# EAGLE design Sensor_LED_PCB (EAGLE 8.0.1)
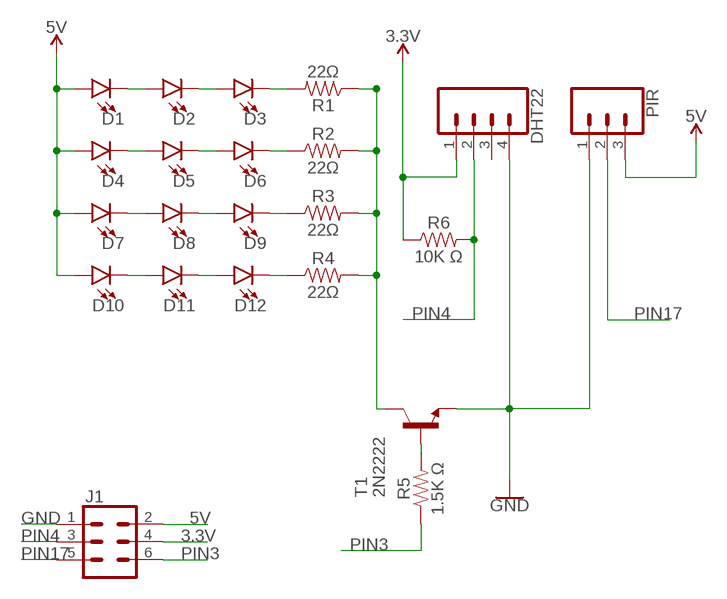
[diagram p0: schematic, sheet 1]

## Parts
D1  LED5MM  [LED_5MM]
D2  LED5MM  [LED_5MM]
D3  LED5MM  [LED_5MM]
D4  LED5MM  [LED_5MM]
D5  LED5MM  [LED_5MM]
D6  LED5MM  [LED_5MM]
D7  LED5MM  [LED_5MM]
D8  LED5MM  [LED_5MM]
D9  LED5MM  [LED_5MM]
D10  LED5MM  [LED_5MM]
D11  LED5MM  [LED_5MM]
D12  LED5MM  [LED_5MM]
DHT22  CONN_04LONGPADS  [1X04_LONGPADS]
J1  CONN_03X2SHROUD  [2X3-SHROUDED]
PIR  CONN_03LONGPADS  [1X03_LONGPADS]
R1  22Ω  10OHM-HORIZ_KIT-1/4W-1%  [AXIAL-0.3-KIT]
R2  22Ω  10OHM-HORIZ_KIT-1/4W-1%  [AXIAL-0.3-KIT]
R3  22Ω  10OHM-HORIZ_KIT-1/4W-1%  [AXIAL-0.3-KIT]
R4  22Ω  10OHM-HORIZ_KIT-1/4W-1%  [AXIAL-0.3-KIT]
R5  1.5K Ω  10OHM-HORIZ_KIT-1/4W-1%  [AXIAL-0.3-KIT]
R6  10K Ω  10OHM-HORIZ_KIT-1/4W-1%  [AXIAL-0.3-KIT]
T1  2N2222  [TO92-EBC-OVAL]

## Nets
3.3V: DHT22.1 J1.4 R6.P$1
5V: D1.A D4.A D7.A D10.A J1.2 PIR.3
GND: DHT22.4 J1.1 PIR.1 T1.E
N$1: D1.K(C) D2.A
N$2: D4.K(C) D5.A
N$3: D7.K(C) D8.A
N$4: R5.P$2 T1.B
N$5: D10.K(C) D11.A
N$6: R1.P$1 R2.P$2 R3.P$2 R4.P$2 T1.C
N$7: D2.K(C) D3.A
N$8: D3.K(C) R1.P$2
N$9: D5.K(C) D6.A
N$10: D8.K(C) D9.A
N$11: D11.K(C) D12.A
N$12: D6.K(C) R2.P$1
N$13: D9.K(C) R3.P$1
N$14: D12.K(C) R4.P$1
PIN3: J1.6 R5.P$1
PIN4: DHT22.2 J1.3 R6.P$2
PIN17: J1.5 PIR.2
Unconnected: DHT22.3

## Library data of the parts
D1-D12 = SparkFun-LED:LED: LED (Generic) Standard schematic elements and footprints for 5mm, 3mm, 1206, and 0603 sized LEDs. Generic LEDs with no color specified.
DHT22 = SparkFun-Connectors:CONN_04: Multi connection point. Often used as Generic Header-pin footprint for 0.1 inch spaced/style header connections On any of the 0.1 inch spaced packages, you can populate with these: Break Away Headers - Straight <https://www.sparkfun.com/products/116> (PRT-00116) Break Away Male Headers - Right Angle <https://www.sparkfun.com/products/553> (PRT-00553) Female Headers <https://www.sparkfun.com/products/115> (PRT-00115) Break Away Headers - Machine Pin <https://www.sparkfun.com/products/117> (PRT-00117) Break Away Female Headers - Swiss Machine Pin <https://www.sparkfun.com/products/743> (PRT-00743) For SCREWTERMINALS and SPRING TERMINALS visit here: Screw Terimnals on SparkFun.com <https://www.sparkfun.com/search/results?term=Screw+Terminals> (5mm/3.5mm/2.54mm spacing) This device is also useful as a general connection point to wire up your design to another part of your project. Our various solder wires solder well into these plated through hole pads. Hook-Up Wire - Assortment (Stranded, 22 AWG) <https://www.sparkfun.com/products/11375> (PRT-11375) Hook-Up Wire - Assortment (Solid Core, 22 AWG) <https://www.sparkfun.com/products/11367> (PRT-11367) View the entire wire category on our website here <https://www.sparkfun.com/categories/141> Special notes: Molex polarized connector foot print use with SKU : PRT-08231 with associated crimp pins and housings. 1MM SMD Version SKU: PRT-10208; PROD_ID: CONN-09696
J1 = SparkFun-Connectors:CONN_03X2: Multi connection point. Often used as Generic Header-pin footprint for 0.1 inch spaced/style header connections You can populate with any combo of single row headers, but if you'd like an exact match, check these: Header - 2x3 (Male, 0.1") <https://www.sparkfun.com/products/12807> (PRT-12807) Header - 2x3 (Female, 0.1") <https://www.sparkfun.com/products/13010> (PRT-13010) 2x3 Pin Shrouded Header <https://www.sparkfun.com/products/10877> (PRT-10877) On any of the 0.1 inch spaced packages, you can populate with these: Break Away Headers - Straight <https://www.sparkfun.com/products/116> (PRT-00116) Break Away Male Headers - Right Angle <https://www.sparkfun.com/products/553> (PRT-00553) Female Headers <https://www.sparkfun.com/products/115> (PRT-00115) Break Away Headers - Machine Pin <https://www.sparkfun.com/products/117> (PRT-00117) Break Away Female Headers - Swiss Machine Pin <https://www.sparkfun.com/products/743> (PRT-00743) Special note: the shrouded connector mates well with our 3x2 ribbon cables: Ribbon Crimp Connector - 6-pin (2x3, Female) <https://www.sparkfun.com/products/10651> (PRT-10651) Ribbon Cable - 6 wire (15ft) <https://www.sparkfun.com/products/10646> (PRT-10646); PROD_ID: CONN-10681; SF_ID: PRT_10877
PIR = SparkFun-Connectors:CONN_03: Multi connection point. Often used as Generic Header-pin footprint for 0.1 inch spaced/style header connections On any of the 0.1 inch spaced packages, you can populate with these: Break Away Headers - Straight <https://www.sparkfun.com/products/116> (PRT-00116) Break Away Male Headers - Right Angle <https://www.sparkfun.com/products/553> (PRT-00553) Female Headers <https://www.sparkfun.com/products/115> (PRT-00115) Break Away Headers - Machine Pin <https://www.sparkfun.com/products/117> (PRT-00117) Break Away Female Headers - Swiss Machine Pin <https://www.sparkfun.com/products/743> (PRT-00743) Stackable Header - 3 Pin (Female, 0.1") <https://www.sparkfun.com/products/13875> (PRT-13875) For SCREWTERMINALS and SPRING TERMINALS visit here: Screw Terimnals on SparkFun.com <https://www.sparkfun.com/search/results?term=Screw+Terminals> (5mm/3.5mm/2.54mm spacing) This device is also useful as a general connection point to wire up your design to another part of your project. Our various solder wires solder well into these plated through hole pads. Hook-Up Wire - Assortment (Stranded, 22 AWG) <https://www.sparkfun.com/products/11375> (PRT-11375) Hook-Up Wire - Assortment (Solid Core, 22 AWG) <https://www.sparkfun.com/products/11367> (PRT-11367) View the entire wire category on our website here <https://www.sparkfun.com/categories/141> Special notes: Molex polarized connector foot print use with SKU : PRT-08232 with associated crimp pins and housings.
R1-R6 = SparkFun-Resistors:10OHM: 10Ω resistor A resistor is a passive two-terminal electrical component that implements electrical resistance as a circuit element. Resistors act to reduce current flow, and, at the same time, act to lower voltage levels within circuits. - Wikipedia; PROD_ID: RES-12180; VALUE: 10
T1 = adafruit:2N2222: NPN TRANSISTOR Big oval pads

## Board
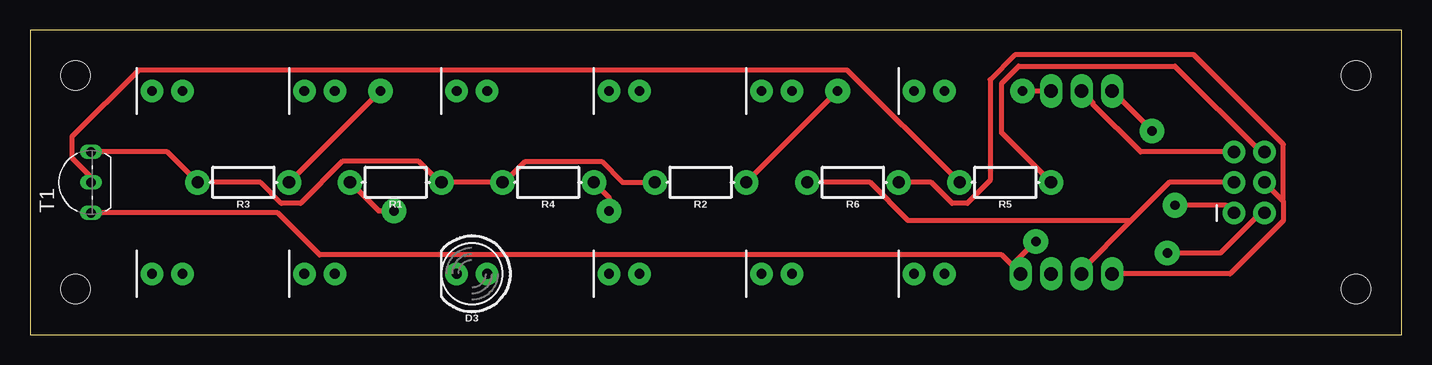
[diagram p1: board, top side]
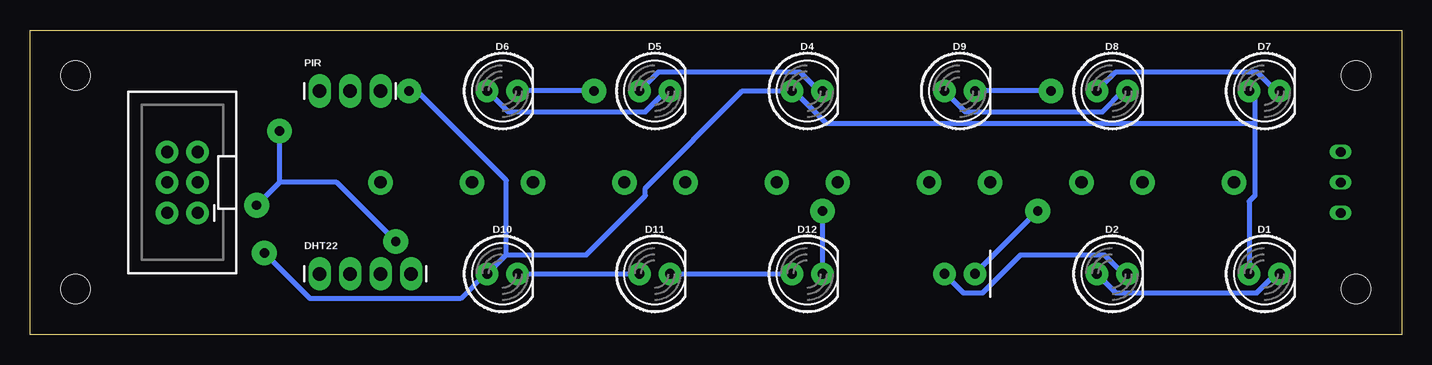
[diagram p2: board, bottom side, seen from below]

Size 114.3 x 25.4 mm. Coordinates in mm from the lower left corner, seen from the top.
Outline: 0,0 114.3,0 114.3,25.4 0,25.4 0,0
Copper layers (1*16): Top 0.035mm / dielectric 1.5mm / Bottom 0.035mm
Design rules "OthermillDRC_1_64_v2 *": minimum track width 16mil, minimum drill 31mil, track to track 0.39878125mm, track to pad 0.39878125mm, pad to pad 0.39878125mm, via to via 0.39878125mm, smd to smd 0mil, copper to edge 0mil, drill to drill 1mil, minimum pad ring 0mil, minimum via ring 25mil, stop-mask expansion 1mil, vias tented up to drill 30mil, thermal gap 10mil
Holes 2.44 mm at 110.49,21.59 3.81,3.81 3.81,21.59 110.49,3.81
tRestrict: area 47,3.8 to 52.1,6.3; area 8.9,19.1 to 14,21.6; area 34.3,19.1 to 39.4,21.6; area 59.7,19.1 to 64.8,21.6; area 47,19.1 to 52.1,21.6; area 72.4,19.1 to 77.5,21.6; area 34.3,3.8 to 39.4,6.3; area 21.6,19.1 to 26.7,21.6; area 59.7,3.8 to 64.8,6.3; area 72.4,3.8 to 77.5,6.3; area 21.6,3.8 to 26.7,6.3; area 8.9,3.8 to 14,6.3
bRestrict: area 99.1,8.9 to 104.1,16.5; area 3.8,8.9 to 6.3,16.5; area 50.8,11.4 to 61,14; area 38.1,11.4 to 48.3,14; area 25.4,11.4 to 35.6,14; area 76.2,11.4 to 86.4,14; area 12.7,11.4 to 22.9,14; area 63.5,11.4 to 73.7,14; area 83.8,19.1 to 91.4,21.6; area 81.3,3.8 to 91.4,6.3
vRestrict: area 96.5,5.1 to 106.7,20.3

### Footprints (pad centres in the part's own frame; a part is rotated, then mirrored left to right if it is on the bottom)
LED_5MM = drill 0.813 pad 1.88: A -1.27,0; K 1.27,0
1X04_LONGPADS = drill 1.118 pad 1.88 long: 1 0,0; 2 2.54,0; 3 5.08,0; 4 7.62,0
2X3-SHROUDED = drill 1.016 pad 1.88: 1 -1.27,2.54; 2 1.27,2.54; 3 -1.27,0; 4 1.27,0; 5 -1.27,-2.54; 6 1.27,-2.54
1X03_LONGPADS = drill 1.118 pad 1.88 long: 1 0,0; 2 2.54,0; 3 5.08,0
AXIAL-0.3-KIT = drill 1.016 pad 2.032: P$1 -3.81,0; P$2 3.81,0
TO92-EBC-OVAL = drill 0.813 long: B 0,-1.27; C 2.54,-1.27; E -2.54,-1.27

### Placement (x,y rotation side)
D1  11.43,5.08 0 bottom
D2  24.13,5.08 0 bottom
D3  36.83,5.08 180 top
D4  49.53,20.32 0 bottom
D5  62.23,20.32 0 bottom
D6  74.93,20.32 0 bottom
D7  11.43,20.32 0 bottom
D8  24.13,20.32 0 bottom
D9  36.83,20.32 0 bottom
D10  74.93,5.08 0 bottom
D11  62.23,5.08 0 bottom
D12  49.53,5.08 0 bottom
DHT22  90.17,5.08 0 bottom
J1  101.6,12.7 180 bottom
PIR  90.17,20.32 0 bottom
R1  30.48,12.7 180 top
R2  55.88,12.7 180 top
R3  17.78,12.7 180 top
R4  43.18,12.7 180 top
R5  81.28,12.7 180 top
R6  68.58,12.7 180 top
T1  3.81,12.7 90 top

### Tracks (layer width: path | path; a pad name or v marks a point on that pad's centre or on a via)
3.3V
  Top 0.406: DHT22.1 100.01,5.08 104.46,9.53 104.46,11.11 | J1.4 104.46,11.11 | R6.P$1 75.09,12.7 76.83,10.95 78.11,10.95 80.01,12.86 80.01,21.27 82.07,23.34 97,23.34 104.46,15.88 104.46,11.11
5V  (via drill 0.79)
  Top 0.406: v82.71,20.32 PIR.3 | J1.2 102.55,10.16 99.22,6.83 v94.77,6.83
  Bottom 0.406: D1.A 12.7,11.11 12.22,11.59 12.22,17.62 | 12.22,17.62 12.22,19.84 D7.A | 74.61,6.67 67.94,6.67 63.02,11.59 63.02,12.22 54.93,20.32 D4.A 50.64,20.32 47.94,17.62 12.22,17.62 | 74.61,6.67 D10.A 76.36,5.08 78.42,3.02 90.96,3.02 v94.77,6.83 | v82.71,20.32 82.07,20.32 74.61,12.86 74.61,6.67
GND  (via drill 0.79)
  Top 0.406: v93.5,16.99 PIR.1 | v95.41,10.79 99.69,10.79 J1.1 | T1.E 20.64,10.16 24.13,6.67 80.96,6.67 DHT22.4 81.92,5.87 v83.82,7.78
  Bottom 0.406: 93.5,12.7 v93.5,16.99 | v95.41,10.79 93.5,12.7 | 93.5,12.7 88.74,12.7 v83.82,7.78
N$1
  Bottom 0.406: D1.K 10.48,5.08 12.06,3.49 23.81,3.49 D2.A
N$2
  Bottom 0.406: D4.K 48.58,20.32 50.16,21.91 61.91,21.91 D5.A
N$3
  Bottom 0.406: D7.K 10.48,20.32 12.06,21.91 23.81,21.91 D8.A
N$4
  Top 0.406: T1.B 5.08,13.18 3.49,14.76 3.49,16.51 9.05,22.07 68.1,22.07 R5.P$2
N$5
  Bottom 0.406: D10.K D11.A
N$6
  Top 0.406: T1.C 11.43,15.24 R3.P$2 19.21,12.7 20.95,10.95 22.54,10.95 26.04,14.45 32.38,14.45 34.13,12.7 R1.P$1 R4.P$2 39.53,12.7 41.27,14.45 47.62,14.45 49.37,12.7 R2.P$2
N$7
  Bottom 0.406: D2.K 23.18,5.08 24.77,6.67 31.75,6.67 34.92,3.49 36.51,3.49 D3.A
N$8  (via drill 0.79)
  Top 0.406: v30.32,10.32 29.05,10.32 R1.P$2
  Bottom 0.406: v30.32,10.32 D3.K
N$9
  Bottom 0.406: D5.K 61.28,20.32 63.02,18.57 74.45,18.57 D6.A
N$10
  Bottom 0.406: D8.K 23.18,20.32 24.92,18.57 36.35,18.57 D9.A
N$11
  Bottom 0.406: D11.K D12.A
N$12  (via drill 0.79)
  Top 0.406: R2.P$1 v67.31,20.32
  Bottom 0.406: v67.31,20.32 D6.K
N$13  (via drill 0.79)
  Top 0.406: R3.P$1 v29.21,20.32
  Bottom 0.406: v29.21,20.32 D9.K
N$14  (via drill 0.79)
  Top 0.406: v48.26,10.32 48.26,11.43 R4.P$1
  Bottom 0.406: v48.26,10.32 D12.K
PIN3
  Top 0.406: J1.6 102.55,15.24 95.41,22.38 82.39,22.38 80.96,20.95 80.96,16.83 R5.P$1
PIN4
  Top 0.406: DHT22.2 87.63,5.4 91.68,9.45 | 91.68,9.45 94.93,12.7 J1.3 | R6.P$2 70.01,12.7 73.18,9.53 91.6,9.53 91.68,9.45
PIN17
  Top 0.406: PIR.2 88.58,19.37 88.58,19.21 92.55,15.24 J1.5